# EasyEDA Pro project letter_rings_01.epro

# Board PCB1
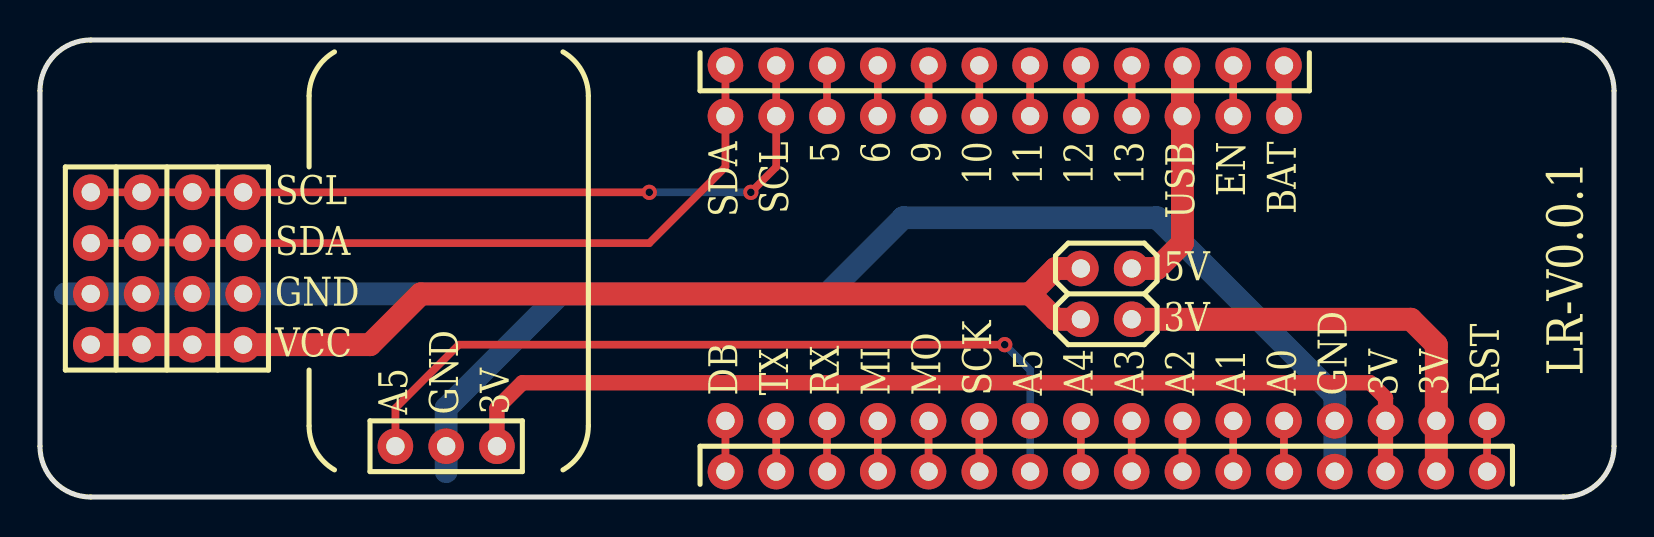
[diagram p0: board, top side]
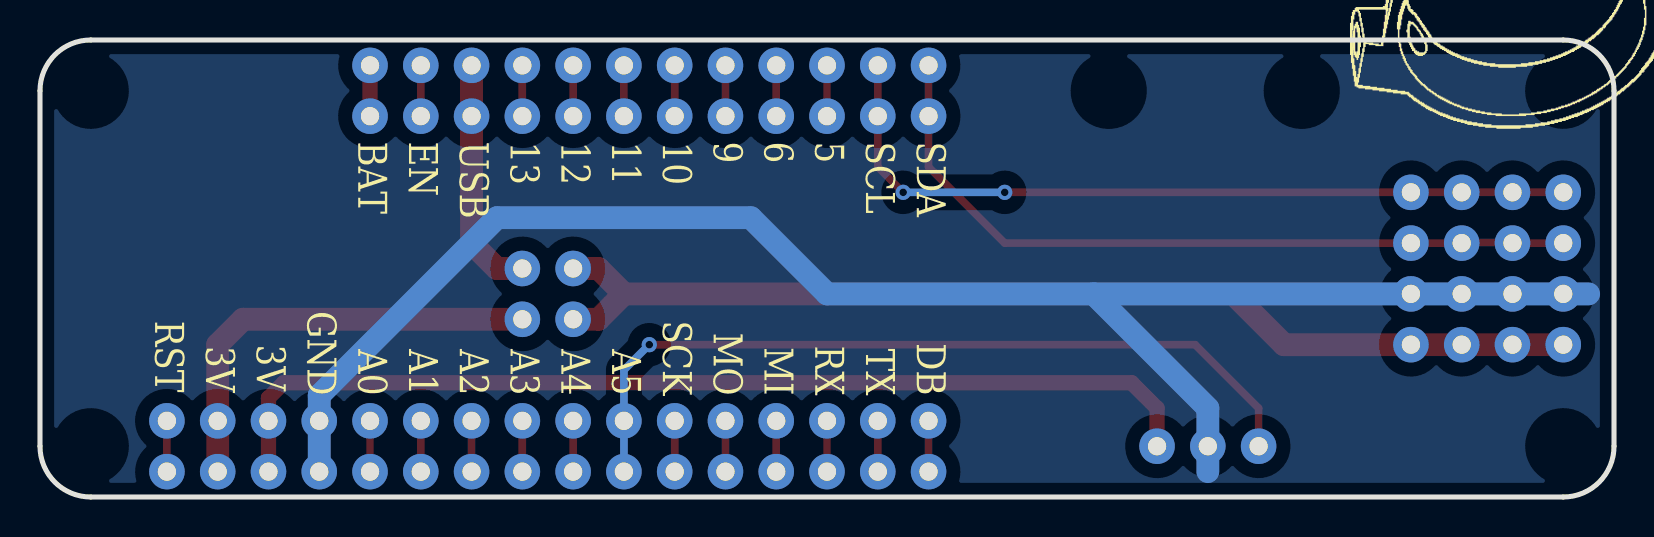
[diagram p1: board, bottom side, seen from below]

Outline 78.74 x 22.86 mm; copper layers: Top Layer, Bottom Layer. Coordinates in mm from the lower left corner of the outline.
Outline path: 0,20.32 0,2.54 arc(0.74,0.74) 2.54,0 76.2,0 arc(78,0.74) 78.74,2.54 78.74,20.32 arc(78,22.12) 76.2,22.86 2.54,22.86 arc(0.74,22.12) 0,20.32
Stack: Top Layer 0.035mm / Dielectric1 1.51mm FR4 er 4.5 / Bottom Layer 0.035mm

## Design rules (mm)
template: Custom Config
spacing copperThickness1oz (default): track to track 0.102, other pairs 0.152 to 0.3
spacing copperThickness2oz: track to track 0.203, other pairs 0.152 to 0.3
track width copperThickness1oz (default): min 0.127, default 0.254, max 2.54
track width copperThickness2oz: min 0.203, default 0.254, max 2.54
differential pair differentialPair (default): width min 0.127, default 0.254, max 2.54; gap min 0.152, default 0.152
via viaSize (default): diameter min 0.5, default 0.61, max 10; hole min 0.3, default 0.305, max 6.3

## Placement (name value [footprint] x y rotation side)
NOREF  -  [Pad_e316]  2.54 12.7 0 top
NOREF#2  -  [Pad_ie43]  34.29 1.27 180 top
NOREF#3  -  [Pad_ie1467]  41.91 3.81 180 top
NOREF#4  -  [Pad_ie1472]  54.61 3.81 270 top
NOREF#5  -  [Pad_e313]  5.08 10.16 0 top
NOREF#6  -  [Pad_ie25]  57.15 21.59 180 top
NOREF#7  -  [Pad_ie1350]  41.91 19.05 180 top
NOREF#8  -  [Pad_ie35]  44.45 1.27 180 top
NOREF#9  -  [Pad_ie1352]  46.99 19.05 180 top
NOREF#10  -  [Pad_ie1358]  62.23 19.05 180 top
NOREF#11  -  [Pad_ie20]  64.77 1.27 180 top
NOREF#12  -  [Pad_e314]  5.08 7.62 0 top
NOREF#13  -  [Pad_ie28]  54.61 21.59 180 top
NOREF#14  -  [Pad_e312]  5.08 12.7 0 top
NOREF#15  -  [Pad_ie36]  44.45 21.59 180 top
NOREF#16  -  [Pad_ie40]  39.37 21.59 180 top
NOREF#17  -  [Pad_ie0]  54.61 8.89 180 top
NOREF#18  -  [Pad_ie1470]  49.53 3.81 180 top
NOREF#19  -  [Pad_ie30]  52.07 21.59 180 top
NOREF#20  -  [Pad_e318]  2.54 7.62 0 top
NOREF#21  -  [Pad_ie1348]  36.83 19.05 180 top
NOREF#22  -  [Pad_ie37]  41.91 1.27 180 top
NOREF#23  -  [Pad_ie34]  46.99 21.59 180 top
NOREF#24  -  [Pad_ie1347]  34.29 19.05 180 top
NOREF#25  -  [Pad_ie22]  62.23 21.59 180 top
NOREF#26  -  [Pad_e315]  2.54 15.24 0 top
NOREF#27  -  [Pad_e79]  20.32 2.54 180 top
NOREF#28  -  [Pad_ie33]  46.99 1.27 180 top
NOREF#29  -  [Pad_ie44]  34.29 21.59 180 top
NOREF#30  -  [Pad_e194]  10.16 12.7 0 top
NOREF#31  -  [Pad_ie26]  57.15 1.27 180 top
NOREF#32  -  [Pad_ie1349]  39.37 19.05 180 top
NOREF#33  -  [Pad_ie1353]  49.53 19.05 180 top
NOREF#34  -  [Pad_ie17]  72.39 1.27 180 top
NOREF#35  -  [Pad_e317]  2.54 10.16 0 top
NOREF#36  -  [Pad_ie1466]  39.37 3.81 180 top
NOREF#37  -  [Pad_e80]  22.86 2.54 270 top
NOREF#38  -  [Pad_ie1471]  52.07 3.81 180 top
NOREF#39  -  [Pad_ie41]  36.83 21.59 180 top
NOREF#40  -  [Pad_e186]  7.62 7.62 0 top
NOREF#41  -  [Pad_ie29]  52.07 1.27 180 top
NOREF#42  -  [Pad_ie1478]  69.85 3.81 180 top
NOREF#43  -  [Pad_ie1474]  59.69 3.81 180 top
NOREF#44  -  [Pad_ie1469]  46.99 3.81 180 top
NOREF#45  -  [Pad_e211]  10.16 15.24 0 top
NOREF#46  -  [Pad_ie47]  52.07 8.89 180 top
NOREF#47  -  [Pad_ie7]  54.61 11.43 180 top
NOREF#48  -  [Pad_ie1355]  54.61 19.05 180 top
NOREF#49  -  [Pad_e191]  7.62 15.24 0 top
NOREF#50  -  [Pad_ie1463]  72.39 3.81 180 top
NOREF#51  -  [Pad_ie1476]  64.77 3.81 180 top
NOREF#52  -  [Pad_e190]  7.62 12.7 0 top
NOREF#53  -  [Pad_e192]  10.16 7.62 0 top
NOREF#54  -  [Pad_ie46]  52.07 11.43 180 top
NOREF#55  -  [Pad_ie39]  39.37 1.27 180 top
NOREF#56  -  [Pad_ie1475]  62.23 3.81 180 top
NOREF#57  -  [Pad_ie32]  49.53 1.27 180 top
NOREF#58  -  [Pad_ie1354]  52.07 19.05 180 top
NOREF#59  -  [Pad_ie1477]  67.31 3.81 180 top
NOREF#60  -  [Pad_ie1357]  59.69 19.05 180 top
NOREF#61  -  [Pad_ie23]  59.69 1.27 180 top
NOREF#62  -  [Pad_e189]  7.62 10.16 0 top
NOREF#63  -  [Pad_ie1465]  36.83 3.81 180 top
NOREF#64  -  [Pad_ie1468]  44.45 3.81 180 top
NOREF#65  -  [Pad_ie27]  54.61 1.27 270 top
NOREF#66  -  [Pad_ie1351]  44.45 19.05 180 top
NOREF#67  -  [Pad_ie18]  69.85 1.27 180 top
NOREF#68  -  [Pad_ie42]  36.83 1.27 180 top
NOREF#69  -  [Pad_ie31]  49.53 21.59 180 top
NOREF#70  -  [Pad_e193]  10.16 10.16 0 top
NOREF#71  -  [Pad_ie19]  67.31 1.27 180 top
NOREF#72  -  [Pad_ie1356]  57.15 19.05 180 top
NOREF#73  -  [Pad_ie1473]  57.15 3.81 180 top
NOREF#74  -  [Pad_ie21]  62.23 1.27 180 top
NOREF#75  -  [Pad_ie1464]  34.29 3.81 180 top
NOREF#76  -  [Pad_ie24]  59.69 21.59 180 top
NOREF#77  -  [Pad_e311]  5.08 15.24 0 top
NOREF#78  -  [Pad_ie38]  41.91 21.59 180 top
NOREF#79  -  [Pad_e78]  17.78 2.54 270 top

## Footprints (pads in the part's own frame, mm; a bottom-side part is the same pattern mirrored in y, then rotated)
Pad_e78
  round 1.778 hole 0.914: (0,0)
Pad_e79
  round 1.778 hole 0.914: (0,0)
Pad_e80
  round 1.778 hole 0.914: (0,0)
Pad_e186
  round 1.778 hole 0.914: (0,0)
Pad_e189
  round 1.778 hole 0.914: (0,0)
Pad_e190
  round 1.778 hole 0.914: (0,0)
Pad_e191
  round 1.778 hole 0.914: (0,0)
Pad_e192
  round 1.778 hole 0.914: (0,0)
Pad_e193
  round 1.778 hole 0.914: (0,0)
Pad_e194
  round 1.778 hole 0.914: (0,0)
Pad_e211
  round 1.778 hole 0.914: (0,0)
Pad_e311
  round 1.778 hole 0.914: (0,0)
Pad_e312
  round 1.778 hole 0.914: (0,0)
Pad_e313
  round 1.778 hole 0.914: (0,0)
Pad_e314
  round 1.778 hole 0.914: (0,0)
Pad_e315
  round 1.778 hole 0.914: (0,0)
Pad_e316
  round 1.778 hole 0.914: (0,0)
Pad_e317
  round 1.778 hole 0.914: (0,0)
Pad_e318
  round 1.778 hole 0.914: (0,0)
Pad_ie0
  round 1.778 hole 0.914: (0,0)
Pad_ie7
  round 1.778 hole 0.914: (0,0)
Pad_ie17
  round 1.778 hole 0.914: (0,0)
Pad_ie18
  round 1.778 hole 0.914: (0,0)
Pad_ie19
  round 1.778 hole 0.914: (0,0)
Pad_ie20
  round 1.778 hole 0.914: (0,0)
Pad_ie21
  round 1.778 hole 0.914: (0,0)
Pad_ie22
  round 1.778 hole 0.914: (0,0)
Pad_ie23
  round 1.778 hole 0.914: (0,0)
Pad_ie24
  round 1.778 hole 0.914: (0,0)
Pad_ie25
  round 1.778 hole 0.914: (0,0)
Pad_ie26
  round 1.778 hole 0.914: (0,0)
Pad_ie27
  round 1.778 hole 0.914: (0,0)
Pad_ie28
  round 1.778 hole 0.914: (0,0)
Pad_ie29
  round 1.778 hole 0.914: (0,0)
Pad_ie30
  round 1.778 hole 0.914: (0,0)
Pad_ie31
  round 1.778 hole 0.914: (0,0)
Pad_ie32
  round 1.778 hole 0.914: (0,0)
Pad_ie33
  round 1.778 hole 0.914: (0,0)
Pad_ie34
  round 1.778 hole 0.914: (0,0)
Pad_ie35
  round 1.778 hole 0.914: (0,0)
Pad_ie36
  round 1.778 hole 0.914: (0,0)
Pad_ie37
  round 1.778 hole 0.914: (0,0)
Pad_ie38
  round 1.778 hole 0.914: (0,0)
Pad_ie39
  round 1.778 hole 0.914: (0,0)
Pad_ie40
  round 1.778 hole 0.914: (0,0)
Pad_ie41
  round 1.778 hole 0.914: (0,0)
Pad_ie42
  round 1.778 hole 0.914: (0,0)
Pad_ie43
  round 1.778 hole 0.914: (0,0)
Pad_ie44
  round 1.778 hole 0.914: (0,0)
Pad_ie46
  round 1.778 hole 0.914: (0,0)
Pad_ie47
  round 1.778 hole 0.914: (0,0)
Pad_ie1347
  round 1.778 hole 0.914: (0,0)
Pad_ie1348
  round 1.778 hole 0.914: (0,0)
Pad_ie1349
  round 1.778 hole 0.914: (0,0)
Pad_ie1350
  round 1.778 hole 0.914: (0,0)
Pad_ie1351
  round 1.778 hole 0.914: (0,0)
Pad_ie1352
  round 1.778 hole 0.914: (0,0)
Pad_ie1353
  round 1.778 hole 0.914: (0,0)
Pad_ie1354
  round 1.778 hole 0.914: (0,0)
Pad_ie1355
  round 1.778 hole 0.914: (0,0)
Pad_ie1356
  round 1.778 hole 0.914: (0,0)
Pad_ie1357
  round 1.778 hole 0.914: (0,0)
Pad_ie1358
  round 1.778 hole 0.914: (0,0)
Pad_ie1463
  round 1.778 hole 0.914: (0,0)
Pad_ie1464
  round 1.778 hole 0.914: (0,0)
Pad_ie1465
  round 1.778 hole 0.914: (0,0)
Pad_ie1466
  round 1.778 hole 0.914: (0,0)
Pad_ie1467
  round 1.778 hole 0.914: (0,0)
Pad_ie1468
  round 1.778 hole 0.914: (0,0)
Pad_ie1469
  round 1.778 hole 0.914: (0,0)
Pad_ie1470
  round 1.778 hole 0.914: (0,0)
Pad_ie1471
  round 1.778 hole 0.914: (0,0)
Pad_ie1472
  round 1.778 hole 0.914: (0,0)
Pad_ie1473
  round 1.778 hole 0.914: (0,0)
Pad_ie1474
  round 1.778 hole 0.914: (0,0)
Pad_ie1475
  round 1.778 hole 0.914: (0,0)
Pad_ie1476
  round 1.778 hole 0.914: (0,0)
Pad_ie1477
  round 1.778 hole 0.914: (0,0)
Pad_ie1478
  round 1.778 hole 0.914: (0,0)

## Nets
3V3A: NOREF#37. NOREF#59. NOREF#71.
3V3B: NOREF#17. NOREF#42. NOREF#67.
GND: NOREF#5. NOREF#11. NOREF#27. NOREF#35. NOREF#51. NOREF#62. NOREF#70.
VBAT: NOREF#10. NOREF#25.
VCC: NOREF#12. NOREF#20. NOREF#40. NOREF#46. NOREF#53. NOREF#54.
A00: NOREF#56. NOREF#74.
A01: NOREF#43. NOREF#61.
A02: NOREF#31. NOREF#73.
A03: NOREF#4. NOREF#65.
A04: NOREF#38. NOREF#41.
A05: NOREF#18. NOREF#57. NOREF#79.
D05: NOREF#16. NOREF#32.
D06: NOREF#7. NOREF#78.
D09: NOREF#15. NOREF#66.
D10: NOREF#9. NOREF#23.
D11: NOREF#33. NOREF#69.
D12: NOREF#19. NOREF#58.
D13: NOREF#13. NOREF#48.
EN: NOREF#60. NOREF#76.
MISO: NOREF#3. NOREF#22.
MOSI: NOREF#8. NOREF#64.
RESET: NOREF#34. NOREF#50.
RX: NOREF#36. NOREF#55.
SCK: NOREF#28. NOREF#44.
SCL: NOREF#21. NOREF#26. NOREF#39. NOREF#45. NOREF#49. NOREF#77.
SDA: NOREF. NOREF#14. NOREF#24. NOREF#29. NOREF#30. NOREF#52.
TX: NOREF#63. NOREF#68.
TXD0: NOREF#2. NOREF#75.
USB: NOREF#6. NOREF#47. NOREF#72.

## Via types
v1: diameter 0.762, hole 0.381, Top Layer to Bottom Layer, 3 vias

## Routing (per net, layer and track width the routed paths; a pad name or vN(x,y) marks a point on that pad's centre or on a via; arc(x,y) is an arc through that point)
3V3A: length 50.9
  Top Layer w0.762: 67.31,1.27 67.31,4.95 66.55,5.72 24.13,5.72 22.86,4.44 22.86,2.54
3V3B: length 22.1
  Top Layer w1.143: 54.61,8.89 68.58,8.89 69.85,7.62 69.85,1.27
GND: length 83.8
  Bottom Layer w1.143: 64.77,1.27 64.77,5.08 55.88,13.97 43.18,13.97 39.37,10.16 26.03,10.16 ; 20.32,1.27 20.32,4.44 26.03,10.16 ; 26.03,10.16 1.27,10.16
VBAT: length 2.5
  Top Layer w0.762: 62.23,21.59 62.23,19.05
VCC: length 54.2
  Top Layer w1.143: 49.53,10.16 19.05,10.16 16.51,7.62 2.54,7.62 ; 49.53,10.16 50.8,8.89 52.07,8.89 ; 49.53,10.16 50.8,11.43 52.07,11.43
A00: length 2.5
  Top Layer w0.381: 62.23,3.81 62.23,1.27
A01: length 2.5
  Top Layer w0.381: 59.69,3.81 59.69,1.27
A02: length 2.5
  Top Layer w0.381: 57.15,3.81 57.15,1.27
A03: length 2.5
  Top Layer w0.381: 54.61,3.81 54.61,1.27
A04: length 2.5
  Top Layer w0.381: 52.07,3.81 52.07,1.27
A05: length 40.6
  Top Layer w0.381: 17.78,2.54 17.78,4.44 20.95,7.62 v1(48.26,7.62)
  Bottom Layer w0.381: v1(48.26,7.62) 49.53,6.35 49.53,1.27
D05: length 2.5
  Top Layer w0.381: 39.37,21.59 39.37,19.05
D06: length 2.5
  Top Layer w0.381: 41.91,21.59 41.91,19.05
D09: length 2.5
  Top Layer w0.381: 44.45,21.59 44.45,19.05
D10: length 2.5
  Top Layer w0.381: 46.99,21.59 46.99,19.05
D11: length 2.5
  Top Layer w0.381: 49.53,21.59 49.53,19.05
D12: length 2.5
  Top Layer w0.381: 52.07,21.59 52.07,19.05
D13: length 2.5
  Top Layer w0.381: 54.61,21.59 54.61,19.05
EN: length 2.5
  Top Layer w0.381: 59.69,21.59 59.69,19.05
MISO: length 2.5
  Top Layer w0.381: 41.91,3.81 41.91,1.27
MOSI: length 2.5
  Top Layer w0.381: 44.45,3.81 44.45,1.27
RESET: length 2.5
  Top Layer w0.381: 72.39,3.81 72.39,1.27
RX: length 2.5
  Top Layer w0.381: 39.37,3.81 39.37,1.27
SCK: length 2.5
  Top Layer w0.381: 46.99,3.81 46.99,1.27
SCL: length 39.9
  Top Layer w0.381: 2.54,15.24 v1(30.48,15.24) ; v1(35.56,15.24) 36.83,16.51 36.83,21.59
  Bottom Layer w0.381: v1(30.48,15.24) v1(35.56,15.24)
SDA: length 38.4
  Top Layer w0.254: 7.59,12.73 7.62,12.7 ; 5.08,12.7 5.11,12.73
  Top Layer w0.381: 2.54,12.7 5.08,12.7 ; 5.11,12.73 7.59,12.73 ; 34.29,21.59 34.29,16.51 30.48,12.7 7.62,12.7
TX: length 2.5
  Top Layer w0.381: 36.83,3.81 36.83,1.27
TXD0: length 2.5
  Top Layer w0.381: 34.29,3.81 34.29,1.27
USB: length 12
  Top Layer w1.143: 54.61,11.43 55.88,11.43 57.15,12.7 57.15,21.59

## Copper pours and planes (outline as drawn; the poured copper is in the pictures)
GND on Bottom Layer: 88.9,-12.06 -12.7,-12.06 -12.7,34.29 88.9,34.29

## Text on the board
Bottom Silkscreen Layer: SDA | SCL | 5 | 6 | 9 | 10 | 11 | 12 | 13 | USB | EN | BAT | DB | TX | RX | MI | MO | SCK | A5 | A4 | A3 | A2 | A1 | A0 | GND | 3V | RST
Top Silkscreen Layer: SCL | SDA | GND | VCC | 5V | 3V | A5 | DB | TX | RX | MI | MO | SCK | A4 | A3 | A2 | A1 | A0 | RST | 5 | 6 | 9 | 10 | 11 | 12 | 13 | USB | EN | BAT | LR-V0.0.1
